# EAGLE schematic AutoWindowOpener (EAGLE 9.5.0)
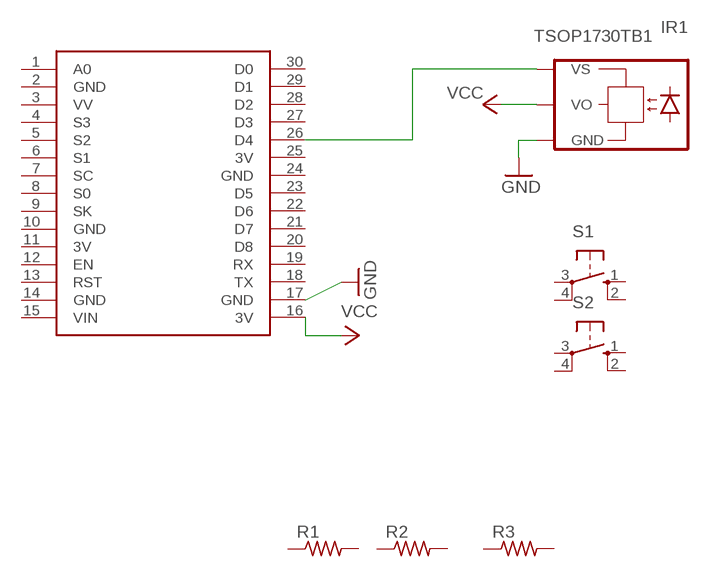
[diagram p0: schematic, sheet 1]

## Parts
IR1  TSOP1730TB1  [TSOP17_TB1]
NODEMCU  NODEMCU  [NODEMCU]
R1  R-US_0204/5  [0204/5]
R2  R-US_0204/5  [0204/5]
R3  R-US_0204/5  [0204/5]
S1  10-XX  [B3F-10XX]
S2  10-XX  [B3F-10XX]

## Nets
GND: IR1.GND NODEMCU.17(GND)
N$3: IR1.VS NODEMCU.26(D4)
VCC: IR1.VO NODEMCU.16(3V)
Unconnected: NODEMCU.1(A0) NODEMCU.3(VV) NODEMCU.4(S3) NODEMCU.5(S2) NODEMCU.6(S1) NODEMCU.7(SC) NODEMCU.8(S0) NODEMCU.9(SK) NODEMCU.12(EN) NODEMCU.13(RST) NODEMCU.15(VIN) NODEMCU.18(TX) NODEMCU.19(RX) NODEMCU.20(D8) NODEMCU.21(D7) NODEMCU.22(D6) NODEMCU.23(D5) NODEMCU.27(D3) NODEMCU.28(D2) NODEMCU.29(D1) NODEMCU.30(D0) R1.1 R1.2 R2.1 R2.2 R3.1 R3.2 S1.1(S) S1.2(S1) S1.3(P) S1.4(P1) S2.1(S) S2.2(S1) S2.3(P) S2.4(P1)

## Power pins joined to a net without a drawn wire
3V: NODEMCU.11(3V) NODEMCU.25(3V)
GND: NODEMCU.2(GND) NODEMCU.10(GND) NODEMCU.14(GND) NODEMCU.24(GND)

## Library data of the parts
IR1 = telefunken:TSOP17*TB1: TSOP17..TB1 IR Receiver Modules for Remote Control Systems Source: http://www.vishay.com/docs/82042/82042.pdf; OC_FARNELL: unknown; OC_NEWARK: unknown
NODEMCU = nodemcu:NODEMCU
R1-R3 = rcl:R-US_: RESISTOR, American symbol; SPICEPREFIX: R
S1 S2 = switch-omron:10-XX: OMRON SWITCH; MPN: B3F-1000; OC_FARNELL: 176432; OC_NEWARK: 36M3542